# Altium schematic sheet voltage_ref.SchDoc: Hall / Hub Board / Voltage ref.
size A4; DocumentNumber: 7; SheetNumber: 7; SheetTotal: 7
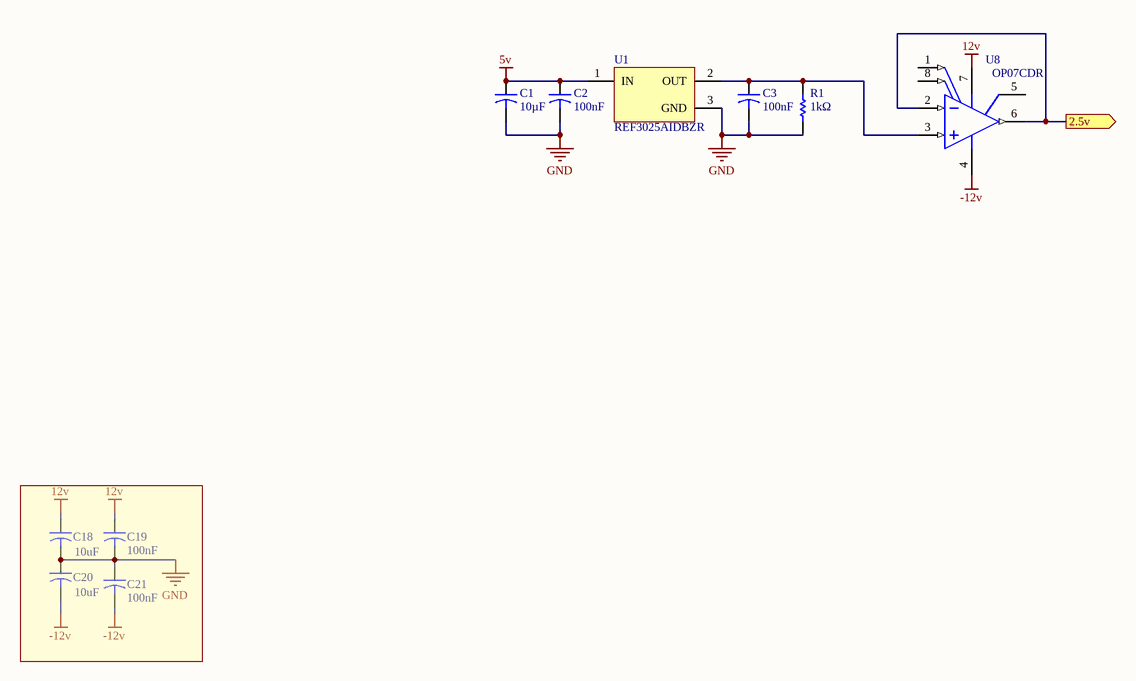
[diagram p0: voltage_ref.SchDoc]

## Parts
C1  Capacitance: 10µF  [CAP 1206/3216]
C2  Capacitance: 100nF  [CAP 0805/2012]
C3  Capacitance: 100nF  [CAP 0805/2012]
C18  value 10uF  [CAP 1206/3216]  (hidden comment: Cap2)
C19  Capacitance: 100nF  [CAP 0805/2012]
C20  value 10uF  [CAP 1206/3216]  (hidden comment: Cap2)
C21  Capacitance: 100nF  [CAP 0805/2012]
R1  Resistance: 1kΩ  [RES 0805/2012]
U1  (no value)  [TI-DBZ3_N]
U8  (no value)  [TI-D8_N]

## Ports
2.5v (out)

## Nets
5v: C1.1 C2.1 U1.1(IN)
12v: C18.1 C19.1 U8.7(VCC+)
-12v: C20.2 C21.2 U8.4(VCC-)
GND: C1.2 C2.2 C3.2 C18.2 C19.2 C20.1 C21.1 R1.2 U1.3(GND)
2.5v: U8.2(IN-) U8.6(OUT) ; port 2.5v
NetC3_1: C3.1 R1.1 U1.2(OUT) U8.3(IN+)

Not connected (* = marked no-connect by the designer): U8 1(OFFSET_N1) 5(NC) 8(OFFSET_N2)

## Notes on the sheet
- Title
- Size:
- Date:
- A4
- Number:
- Time:
- Revision:
- Sheet
- of
- Fermium LABS srl
- Via Monselice 15a
- 35142 Padova PD
- Italy
- File:

## Library data of the parts
C1 = Cap2: Capacitor; Manufacturer: SAMSUNG; Manufacturer Part Number: CL31A106KAHNNNE; Unit: pcs; SuppliedAmount: 0; MinAmount: 100; Capacitor type: ceramic; Capacitor kind: MLCC; Operating voltage: 25V; Dielectric: X5R; Tolerance: ±10%; Case - inch: 1206; Case - mm: 3216; Pads: 2 SMD; Published: 23-Sep-2002; PackageReference: CAPR5-4X5; Publisher: Altium Limited; PackageDescription: 1206; Supplier 1: TME; Supplier Part Number 1: CL31A106KAHNNNE; Category: 1206 MLCC SMD Capacitors; Stock 1: 279700; Pricing 1: 100=0.0248, 300=0.0203, 1000=0.0167, 2000=0.0131, 10000=0.0127 (EUR); Weight: 0.061; Multiples: 100; Mounting: SMD; Operating temperature: -55...85°C; Price Type: NET; ComponentLink1URL: http://static.tme.eu/products_pics/b/e/9/be9e0dd298dcf4979ea1dd3d226e0bfa/58780.jpg; ComponentLink1Description: http://static.tme.eu/products_pics/b/e/9/be9e0dd298dcf4979ea1dd3d226e0bfa/58780.jpg
C2 = Cap2: Capacitor; Manufacturer: YAGEO; Manufacturer Part Number: CC0805JRX7R9BB104; Unit: pcs; SuppliedAmount: 0; MinAmount: 100; Capacitor type: ceramic; Capacitor kind: MLCC; Operating voltage: 50V; Dielectric: X7R; Tolerance: ±5%; Case - inch: 0805; Case - mm: 2012; Supplier 1: TME; Supplier Part Number 1: CC0805JRX7R9104; Category: 0805 MLCC SMD Capacitors; Stock 1: 89911; Pricing 1: 100=0.00613, 300=0.00464, 1000=0.00342, 4000=0.00284, 20000=0.00273 (EUR); Weight: 0.042; Multiples: 100; Mounting: SMD; Price Type: NET; ComponentLink1URL: http://static.tme.eu/products_pics/d/b/b/dbbd93eaf25225110ca26eb66da77328/58538.jpg; ComponentLink1Description: http://static.tme.eu/products_pics/d/b/b/dbbd93eaf25225110ca26eb66da77328/58538.jpg; Pads: *
C3 C19 C21 = Cap2: Capacitor; Manufacturer: YAGEO; Manufacturer Part Number: CC0805JRX7R9BB104; Unit: pcs; SuppliedAmount: 0; MinAmount: 100; Capacitor type: ceramic; Capacitor kind: MLCC; Operating voltage: 50V; Dielectric: X7R; Tolerance: ±5%; Case - inch: 0805; Case - mm: 2012; Pads: 2 SMD; Supplier 1: TME; Supplier Part Number 1: CC0805JRX7R9104; Category: 0805 MLCC SMD Capacitors; Stock 1: 89911; Pricing 1: 100=0.00613, 300=0.00464, 1000=0.00342, 4000=0.00284, 20000=0.00273 (EUR); Weight: 0.042; Multiples: 100; Mounting: SMD; Price Type: NET; ComponentLink1URL: http://static.tme.eu/products_pics/d/b/b/dbbd93eaf25225110ca26eb66da77328/58538.jpg; ComponentLink1Description: http://static.tme.eu/products_pics/d/b/b/dbbd93eaf25225110ca26eb66da77328/58538.jpg
C18 C20 = Cap2: Capacitor; Manufacturer: SAMSUNG; Manufacturer Part Number: CL31A106KAHNNNE; Unit: pcs; SuppliedAmount: 0; MinAmount: 100; Capacitor type: ceramic; Capacitor kind: MLCC; Capacitance: 10µF; Operating voltage: 25V; Dielectric: X5R; Tolerance: ±10%; Case - inch: 1206; Case - mm: 3216; Pads: 2 SMD; Published: 23-Sep-2002; PackageReference: CAPR5-4X5; Publisher: Altium Limited; PackageDescription: 1206; Supplier 1: TME; Supplier Part Number 1: CL31A106KAHNNNE; Category: 1206 MLCC SMD Capacitors; Stock 1: 279700; Pricing 1: 100=0.0248, 300=0.0203, 1000=0.0167, 2000=0.0131, 10000=0.0127 (EUR); Weight: 0.061; Multiples: 100; Mounting: SMD; Operating temperature: -55...85°C; Price Type: NET; ComponentLink1URL: http://static.tme.eu/products_pics/b/e/9/be9e0dd298dcf4979ea1dd3d226e0bfa/58780.jpg; ComponentLink1Description: http://static.tme.eu/products_pics/b/e/9/be9e0dd298dcf4979ea1dd3d226e0bfa/58780.jpg
R1 = Res1: Resistor; Manufacturer: VIKING; Manufacturer Part Number: AR05BTCW1001; Manufacturer series: AR; Unit: pcs; SuppliedAmount: 0; MinAmount: 10; Kind of resistor: precise; Case - inch: 0805; Case - mm: 2012; Power: 0.125W; Tolerance: ±0.1%; Max. operating voltage: 150V; Max. overload voltage: 300V; Temperature coefficient: 25ppm/°C; Pads: 2 SMD; Published: 8-Jun-2000; LatestRevisionDate: 17-Jul-2002; LatestRevisionNote: Re-released for DXP Platform.; PackageReference: AXIAL-0.3; Publisher: Altium Limited; PackageDescription: Axial Device, Thru-Hole; 2 Leads; 0.3 in Pin Spacing; Supplier 1: TME; Supplier Part Number 1: AR0805-1K-0.1%; Category: 0805 SMD Precision Resistors; Stock 1: 0; Pricing 1: 10=0.11211, 100=0.05707, 1000=0.03771, 5000=0.03176 (EUR); Weight: 0.034; Multiples: 10; Resistor type: thin film; Mounting: SMD; Operating temperature: -55...155°C; Price Type: NET; ComponentLink1URL: http://static.tme.eu/products_pics/6/6/c/66cc5cd64257edd80ca8e9fd2040972d/56038.jpg; ComponentLink1Description: http://static.tme.eu/products_pics/6/6/c/66cc5cd64257edd80ca8e9fd2040972d/56038.jpg; Supplier 2: TME; Supplier Part Number 2: AR0805-1K13-0.1%; Stock 2: 750; Pricing 2: 10=0.11119, 100=0.05661, 1000=0.0374, 5000=0.0315 (EUR)
U1 = REF3025AIDBZR: Voltage reference, 2.5V; Manufacturer: Texas Instruments; Accuracy: 100 uV/mA; Temperature Coefficient: 50 PPM / C; Reference Type: Series References; Series VREF - Input Voltage - Max: 5.5 V; Shunt Current - Max: 25 mA; Supply Current - Max: 50 uA; Initial Accuracy: 0.2 %; Operating Supply Current: 42 uA; Pads: 3 SMD; Supplier 1: Mouser; Supplier Part Number 1: 595-REF3025AIDBZR; Manufacturer Part Number: REF3025AIDBZR; RoHS: RoHS Compliant; Category: Voltage References; Stock 1: 2808; Pricing 1: 1=1.29, 10=1.15, 25=1.06, 50=0.950, 100=0.900, 250=0.841, 500=0.743, 1000=0.508, 3000=0.508 (EUR); Height: 1 mm; Length: 2.92 mm; Operating Temperature Range: - 40 C to + 125 C; Output Voltage: 2.5 V; Package / Case: SOT-23-3; Packaging: Reel; Product: Voltage References; Series: REF3025; Width: 1.3 mm; Brand: Texas Instruments; Mounting Style: SMD/SMT; Topology: Series References; Maximum Operating Temperature: + 125 C; Minimum Operating Temperature: - 40 C; Standard Pack Qty: 3000; RoHS - Mouser: Y; Minimum Order Quantity: 1; Reeling: True
U8 = OP07CDR: Low-Offset Voltage Operational Amplifier, 6 to 36 V, 0 to 70 degC, 8-pin SOIC (D8), Green (RoHS & no Sb/Br); Manufacturer: TEXAS INSTRUMENTS; Unit: pcs; SuppliedAmount: 0; MinAmount: 3; Multiples: 1; Transmission band frequency: 600kHz; Supply voltage: 3...18V DC; Slew rate: 0.3V/μs; Pads: 8 SMD; Supplier 1: TME; Supplier Part Number 1: OP07CDR; Manufacturer Part Number: OP07CDR; Category: SMD Operational Amplifiers; Stock 1: 2258; Pricing 1: 3=0.2668, 10=0.2451, 50=0.2177, 250=0.1848, 1000=0.165 (EUR); Weight: 0.23; Integrated circuit type: operational amplifier; Mounting: SMD; Number of channels: 1; Case: SO8; Price Type: NET; ComponentLink1URL: http://static.tme.eu/products_pics/4/8/a/48a33ccfb5a851d5982dcdda0776f7ac/285338.jpg; ComponentLink1Description: http://static.tme.eu/products_pics/4/8/a/48a33ccfb5a851d5982dcdda0776f7ac/285338.jpg